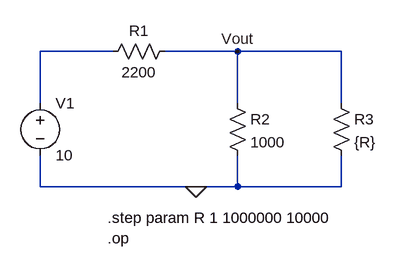
[diagram p0: schematic Divisor_de_corriente.asc]
Divisor_de_corriente.asc, the LTspice schematic file:
Version 4
SHEET 1 880 680
WIRE -432 128 -544 128
WIRE -240 128 -352 128
WIRE -80 128 -240 128
WIRE -544 208 -544 128
WIRE -240 208 -240 128
WIRE -80 208 -80 128
WIRE -544 336 -544 288
WIRE -304 336 -544 336
WIRE -240 336 -240 288
WIRE -240 336 -304 336
WIRE -80 336 -80 288
WIRE -80 336 -240 336
FLAG -304 336 0
FLAG -240 128 Vout
SYMBOL res -336 112 R90
WINDOW 0 0 56 VBottom 2
WINDOW 3 32 56 VTop 2
SYMATTR InstName R1
SYMATTR Value 2200
SYMBOL res -256 192 R0
SYMATTR InstName R2
SYMATTR Value 1000
SYMBOL res -96 192 R0
SYMATTR InstName R3
SYMATTR Value {R}
SYMBOL voltage -544 192 R0
WINDOW 123 0 0 Left 2
WINDOW 39 0 0 Left 2
SYMATTR InstName V1
SYMATTR Value 10
TEXT -440 384 Left 2 !.step param R 1 1000000 10000\n.op

The netlist it stands for:
* Divisor_de_corriente.asc
R1 Vout N001 2200
R2 Vout 0 1000
R3 Vout 0 {R}
V1 N001 0 10
.step param R 1 1000000 10000
.op
.backanno
.end

* Results of the author's LTspice run, read from the files saved beside the schematic
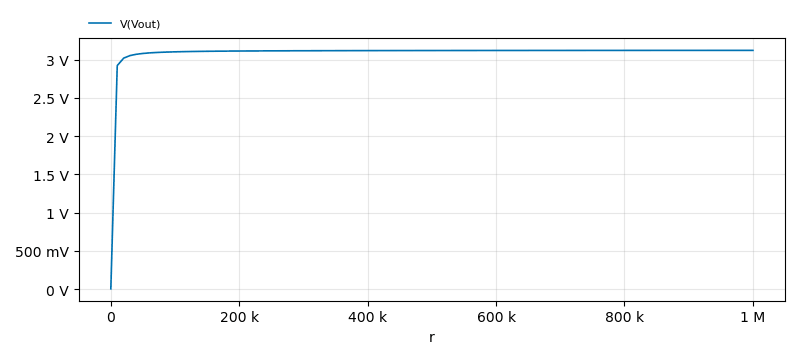
[diagram p1: Operating Point of Divisor_de_corriente.asc, plotted from the saved traces]
* Operating Point, 1 run:
*   V(Vout): 4.539 mV at r=1 , 3.123 V at r=1 M, min 4.539 mV, max 3.123 V